# Altium schematic sheet Opto Input.SchDoc
size 381 x 241 mm; SheetNumber: 9; SheetTotal: 9
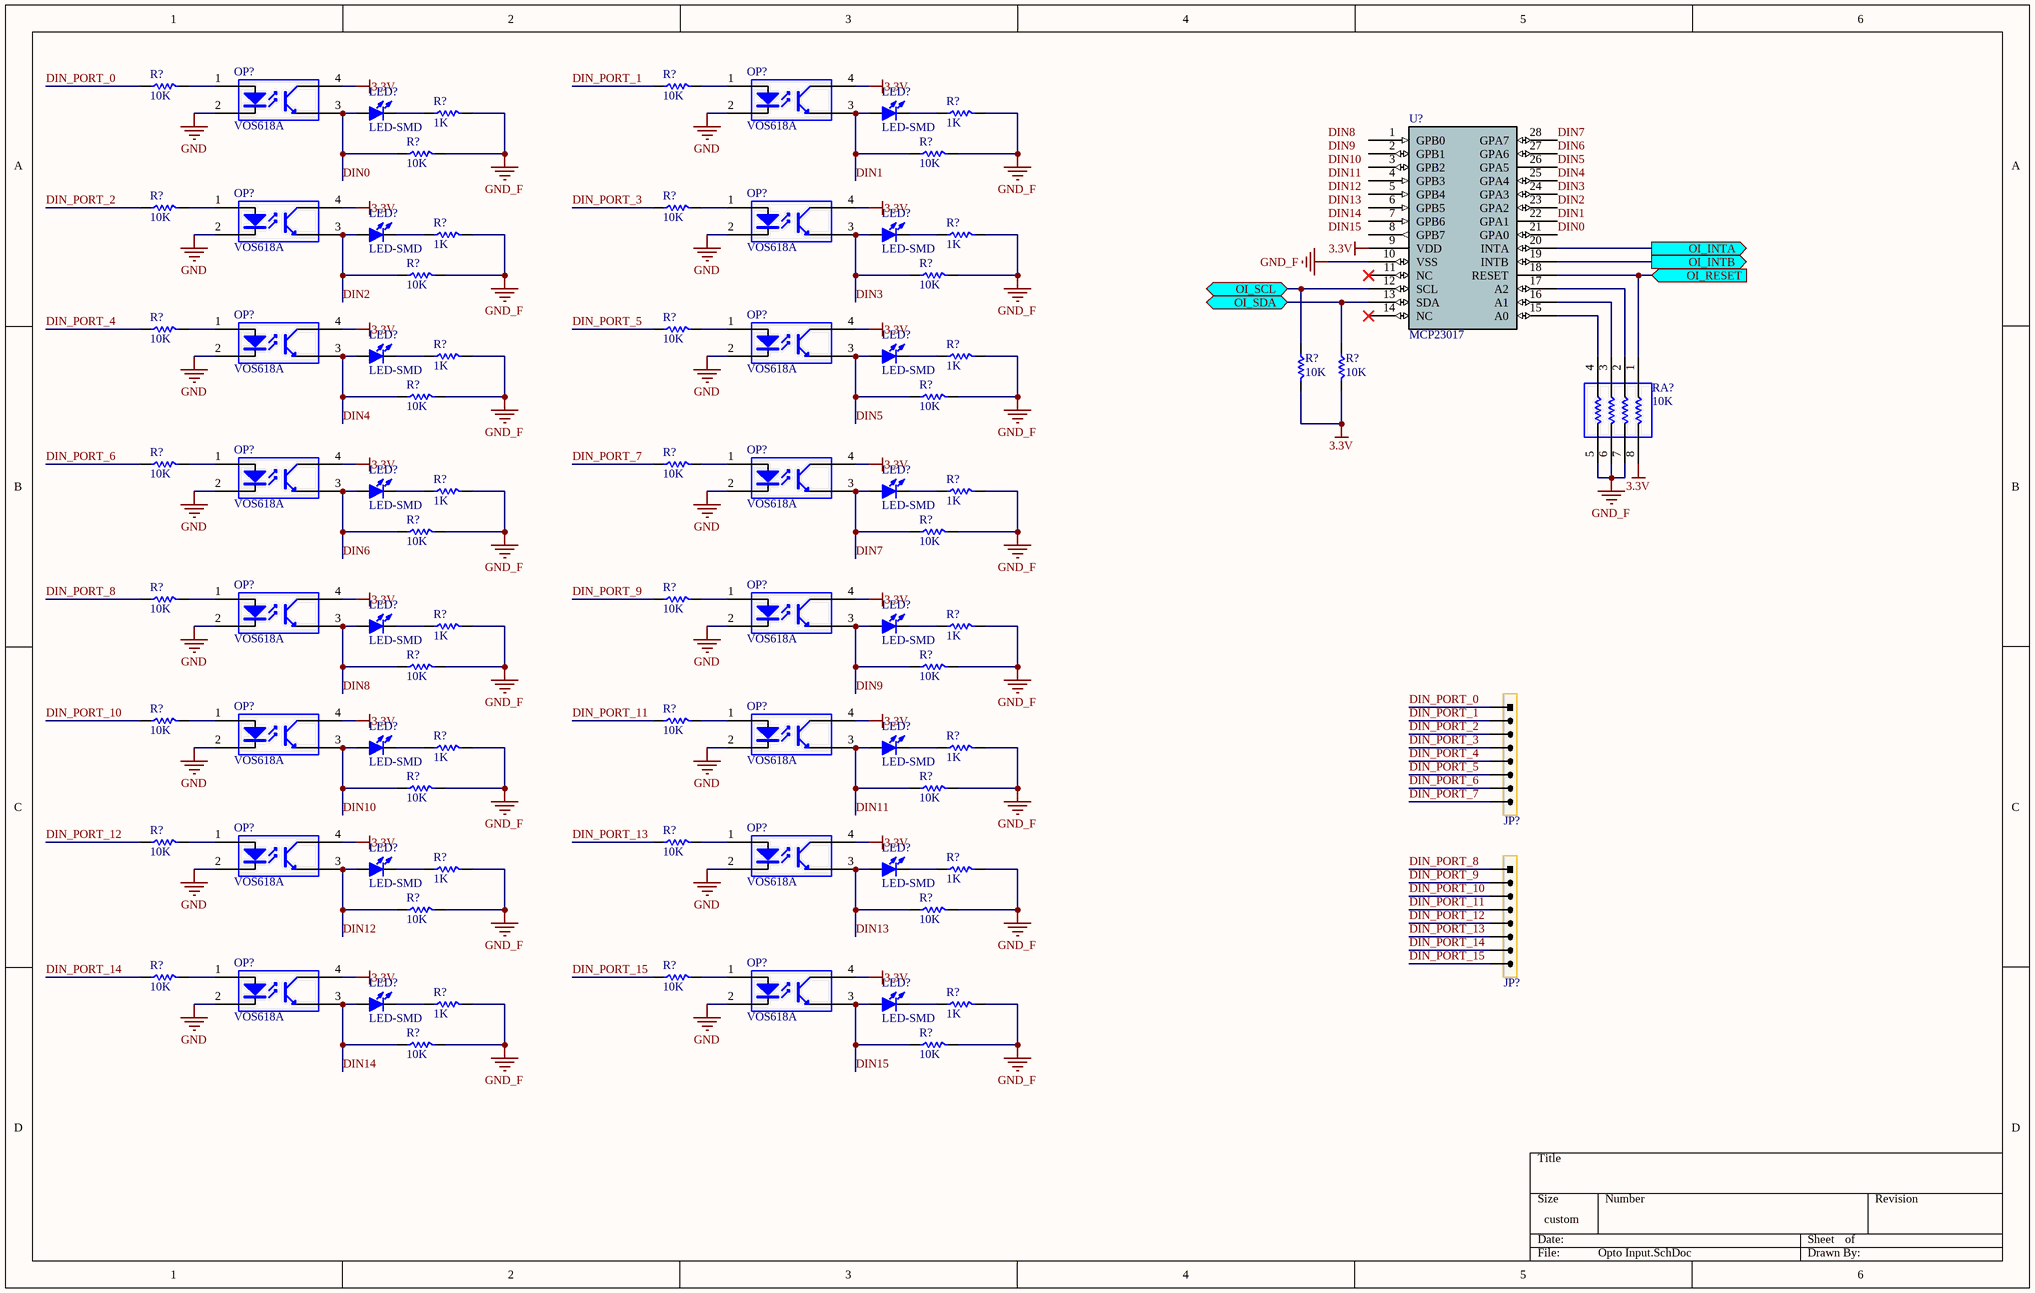
[diagram p0: Opto Input.SchDoc]

## Parts
(Parts that share a designator on the sheet are numbered #1, #2 ... from top to bottom, then left to right.)
JP?#1  HDR-1X8  [KF-8P-BLK-H-3.81]  (value not drawn)
JP?#2  HDR-1X8  [KF-8P-BLK-H-3.81]  (value not drawn)
LED?#1  LED-SMD  [LED 0603G]
LED?#2  LED-SMD  [LED 0603G]
LED?#3  LED-SMD  [LED 0603G]
LED?#4  LED-SMD  [LED 0603G]
LED?#5  LED-SMD  [LED 0603G]
LED?#6  LED-SMD  [LED 0603G]
LED?#7  LED-SMD  [LED 0603G]
LED?#8  LED-SMD  [LED 0603G]
LED?#9  LED-SMD  [LED 0603G]
LED?#10  LED-SMD  [LED 0603G]
LED?#11  LED-SMD  [LED 0603G]
LED?#12  LED-SMD  [LED 0603G]
LED?#13  LED-SMD  [LED 0603G]
LED?#14  LED-SMD  [LED 0603G]
LED?#15  LED-SMD  [LED 0603G]
LED?#16  LED-SMD  [LED 0603G]
OP?#1  VOS618A  [VOS618A-SSOP4]
OP?#2  VOS618A  [VOS618A-SSOP4]
OP?#3  VOS618A  [VOS618A-SSOP4]
OP?#4  VOS618A  [VOS618A-SSOP4]
OP?#5  VOS618A  [VOS618A-SSOP4]
OP?#6  VOS618A  [VOS618A-SSOP4]
OP?#7  VOS618A  [VOS618A-SSOP4]
OP?#8  VOS618A  [VOS618A-SSOP4]
OP?#9  VOS618A  [VOS618A-SSOP4]
OP?#10  VOS618A  [VOS618A-SSOP4]
OP?#11  VOS618A  [VOS618A-SSOP4]
OP?#12  VOS618A  [VOS618A-SSOP4]
OP?#13  VOS618A  [VOS618A-SSOP4]
OP?#14  VOS618A  [VOS618A-SSOP4]
OP?#15  VOS618A  [VOS618A-SSOP4]
OP?#16  VOS618A  [VOS618A-SSOP4]
R?#1  10K  [R 0603]
R?#2  10K  [R 0603]
R?#3  1K  [R 0603]
R?#4  1K  [R 0603]
R?#5  10K  [R 0603]
R?#6  10K  [R 0603]
R?#7  10K  [R 0603]
R?#8  10K  [R 0603]
R?#9  1K  [R 0603]
R?#10  1K  [R 0603]
R?#11  10K  [R 0603]
R?#12  10K  [R 0603]
R?#13  10K  [R 0603]
R?#14  10K  [R 0603]
R?#15  10K  [R 0805]
R?#16  10K  [R 0805]
R?#17  1K  [R 0603]
R?#18  1K  [R 0603]
R?#19  10K  [R 0603]
R?#20  10K  [R 0603]
R?#21  10K  [R 0603]
R?#22  10K  [R 0603]
R?#23  1K  [R 0603]
R?#24  1K  [R 0603]
R?#25  10K  [R 0603]
R?#26  10K  [R 0603]
R?#27  10K  [R 0603]
R?#28  10K  [R 0603]
R?#29  1K  [R 0603]
R?#30  1K  [R 0603]
R?#31  10K  [R 0603]
R?#32  10K  [R 0603]
R?#33  10K  [R 0603]
R?#34  10K  [R 0603]
R?#35  1K  [R 0603]
R?#36  1K  [R 0603]
R?#37  10K  [R 0603]
R?#38  10K  [R 0603]
R?#39  10K  [R 0603]
R?#40  10K  [R 0603]
R?#41  1K  [R 0603]
R?#42  1K  [R 0603]
R?#43  10K  [R 0603]
R?#44  10K  [R 0603]
R?#45  10K  [R 0603]
R?#46  10K  [R 0603]
R?#47  1K  [R 0603]
R?#48  1K  [R 0603]
R?#49  10K  [R 0603]
R?#50  10K  [R 0603]
RA?  10K  [RA1206 (4x0603)]
U?  MCP23017  [SOIC28]

## Ports
OI_INTA (out), OI_INTB (out), OI_RESET (in), OI_SCL (bidir), OI_SDA (bidir)

## Nets
3.3V: OP?#1.4(C) OP?#2.4(C) OP?#3.4(C) OP?#4.4(C) OP?#5.4(C) OP?#6.4(C) OP?#7.4(C) OP?#8.4(C) OP?#9.4(C) OP?#10.4(C) OP?#11.4(C) OP?#12.4(C) OP?#13.4(C) OP?#14.4(C) OP?#15.4(C) OP?#16.4(C) R?#15.2 R?#16.2 RA?.8 U?.9(VDD)
GND: OP?#1.2(K) OP?#2.2(K) OP?#3.2(K) OP?#4.2(K) OP?#5.2(K) OP?#6.2(K) OP?#7.2(K) OP?#8.2(K) OP?#9.2(K) OP?#10.2(K) OP?#11.2(K) OP?#12.2(K) OP?#13.2(K) OP?#14.2(K) OP?#15.2(K) OP?#16.2(K)
GND_F: R?#3.2 R?#4.2 R?#5.2 R?#6.2 R?#9.2 R?#10.2 R?#11.2 R?#12.2 R?#17.2 R?#18.2 R?#19.2 R?#20.2 R?#23.2 R?#24.2 R?#25.2 R?#26.2 R?#29.2 R?#30.2 R?#31.2 R?#32.2 R?#35.2 R?#36.2 R?#37.2 R?#38.2 R?#41.2 R?#42.2 R?#43.2 R?#44.2 R?#47.2 R?#48.2 R?#49.2 R?#50.2 RA?.5 RA?.6 RA?.7 U?.10(VSS)
DIN0: LED?#1.1(A) OP?#1.3(E) R?#5.1 U?.21(GPA0)
DIN1: LED?#2.1(A) OP?#2.3(E) R?#6.1 U?.22(GPA1)
DIN2: LED?#3.1(A) OP?#3.3(E) R?#11.1 U?.23(GPA2)
DIN3: LED?#4.1(A) OP?#4.3(E) R?#12.1 U?.24(GPA3)
DIN4: LED?#5.1(A) OP?#5.3(E) R?#19.1 U?.25(GPA4)
DIN5: LED?#6.1(A) OP?#6.3(E) R?#20.1 U?.26(GPA5)
DIN6: LED?#7.1(A) OP?#7.3(E) R?#25.1 U?.27(GPA6)
DIN7: LED?#8.1(A) OP?#8.3(E) R?#26.1 U?.28(GPA7)
DIN8: LED?#9.1(A) OP?#9.3(E) R?#31.1
DIN9: LED?#10.1(A) OP?#10.3(E) R?#32.1
DIN10: LED?#11.1(A) OP?#11.3(E) R?#37.1
DIN11: LED?#12.1(A) OP?#12.3(E) R?#38.1
DIN12: LED?#13.1(A) OP?#13.3(E) R?#43.1
DIN13: LED?#14.1(A) OP?#14.3(E) R?#44.1
DIN14: LED?#15.1(A) OP?#15.3(E) R?#49.1
DIN15: LED?#16.1(A) OP?#16.3(E) R?#50.1
DIN_PORT_0: JP?#1.1 R?#1.1
DIN_PORT_1: JP?#1.2 R?#2.1
DIN_PORT_2: JP?#1.3 R?#7.1
DIN_PORT_3: JP?#1.4 R?#8.1
DIN_PORT_4: JP?#1.5 R?#13.1
DIN_PORT_5: JP?#1.6 R?#14.1
DIN_PORT_6: JP?#1.7 R?#21.1
DIN_PORT_7: JP?#1.8 R?#22.1
DIN_PORT_8: JP?#2.1 R?#27.1
DIN_PORT_9: JP?#2.2 R?#28.1
DIN_PORT_10: JP?#2.3 R?#33.1
DIN_PORT_11: JP?#2.4 R?#34.1
DIN_PORT_12: JP?#2.5 R?#39.1
DIN_PORT_13: JP?#2.6 R?#40.1
DIN_PORT_14: JP?#2.7 R?#45.1
DIN_PORT_15: JP?#2.8 R?#46.1
OI_INTA: U?.20(INTA) ; port OI_INTA
OI_INTB: U?.19(INTB) ; port OI_INTB
OI_RESET: RA?.1 U?.18(RESET) ; port OI_RESET
OI_SCL: R?#15.1 U?.12(SCL) ; port OI_SCL
OI_SDA: R?#16.1 U?.13(SDA) ; port OI_SDA
NetLED?#1_2: LED?#1.2(K) R?#3.1
NetLED?#2_2: LED?#2.2(K) R?#4.1
NetLED?#3_2: LED?#3.2(K) R?#9.1
NetLED?#4_2: LED?#4.2(K) R?#10.1
NetLED?#5_2: LED?#5.2(K) R?#17.1
NetLED?#6_2: LED?#6.2(K) R?#18.1
NetLED?#7_2: LED?#7.2(K) R?#23.1
NetLED?#8_2: LED?#8.2(K) R?#24.1
NetLED?#9_2: LED?#9.2(K) R?#29.1
NetLED?#10_2: LED?#10.2(K) R?#30.1
NetLED?#11_2: LED?#11.2(K) R?#35.1
NetLED?#12_2: LED?#12.2(K) R?#36.1
NetLED?#13_2: LED?#13.2(K) R?#41.1
NetLED?#14_2: LED?#14.2(K) R?#42.1
NetLED?#15_2: LED?#15.2(K) R?#47.1
NetLED?#16_2: LED?#16.2(K) R?#48.1
NetOP?#1_1: OP?#1.1(A) R?#1.2
NetOP?#2_1: OP?#2.1(A) R?#2.2
NetOP?#3_1: OP?#3.1(A) R?#7.2
NetOP?#4_1: OP?#4.1(A) R?#8.2
NetOP?#5_1: OP?#5.1(A) R?#13.2
NetOP?#6_1: OP?#6.1(A) R?#14.2
NetOP?#7_1: OP?#7.1(A) R?#21.2
NetOP?#8_1: OP?#8.1(A) R?#22.2
NetOP?#9_1: OP?#9.1(A) R?#27.2
NetOP?#10_1: OP?#10.1(A) R?#28.2
NetOP?#11_1: OP?#11.1(A) R?#33.2
NetOP?#12_1: OP?#12.1(A) R?#34.2
NetOP?#13_1: OP?#13.1(A) R?#39.2
NetOP?#14_1: OP?#14.1(A) R?#40.2
NetOP?#15_1: OP?#15.1(A) R?#45.2
NetOP?#16_1: OP?#16.1(A) R?#46.2
NetRA?_2: RA?.2 U?.17(A2)
NetRA?_3: RA?.3 U?.16(A1)
NetRA?_4: RA?.4 U?.15(A0)

Not connected (* = marked no-connect by the designer): U? 1(GPB0) 2(GPB1) 3(GPB2) 4(GPB3) 5(GPB4) 6(GPB5) 7(GPB6) 8(GPB7) 11(NC)* 14(NC)*

## Notes on the sheet
- Labels drawn without touching a wire or pin: DIN8, DIN9, DIN10, DIN11, DIN12, DIN13, DIN14, DIN15

## Library data of the parts
JP?#1 JP?#2 = Header 8: 8P Connector; BOM名称: 8P接插件; 版权归属: 源创客; 学习资源: www.ooocke.com
LED?#1-LED?#16 = LED-SMD: Patch LED; BOM名称: 贴片LED; 版权归属: 源创客; 学习资源: www.ooocke.com
R?#1-R?#50 = R: Chip resistor; 版权归属: 源创客; BOM名称: Chip resistor; 学习资源: www.ooocke.com
RA? = R-ARR: 4 way Chip Resistor Array